# Altium schematic sheet CHRG 2xCell MCP73213-B6SIMF.SchDoc
size 224 x 90 mm
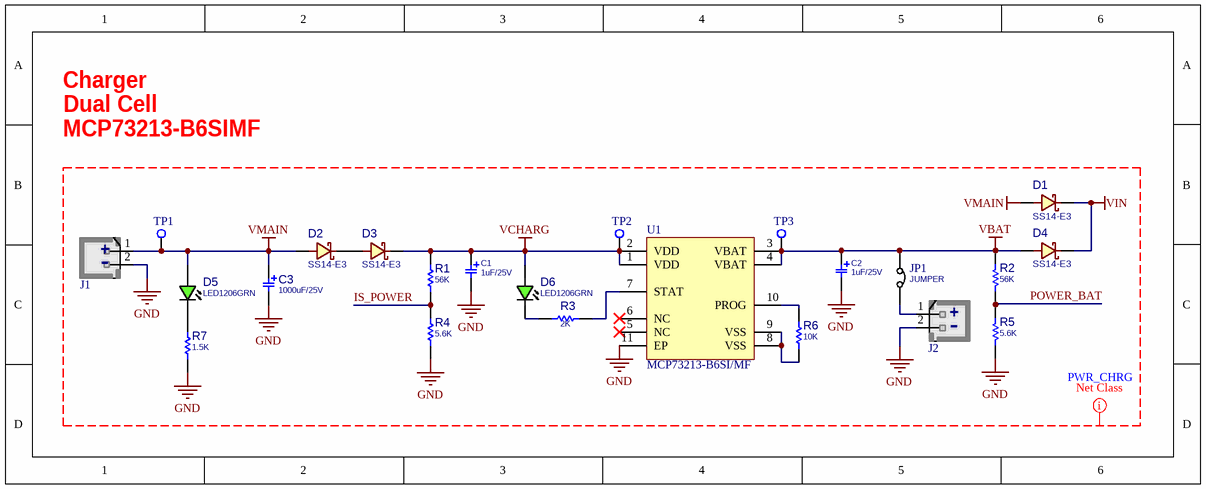
[diagram p0: CHRG 2xCell MCP73213-B6SIMF.SchDoc]

## Parts
C1  1uF/25V  [C_TN_A]
C2  1uF/25V  [C_TN_A]
C3  1000uF/25V  [C_EL_10X20]
D1  SS14-E3  [D_SMA]
D2  SS14-E3  [D_SMA]
D3  SS14-E3  [D_SMA]
D4  SS14-E3  [D_SMA]
D5  LED1206GRN  [LED1206GRN]
D6  LED1206GRN  [LED1206GRN]
J1  HHDR_2  [XH_2]  (value not drawn)
J2  HHDR_2  [XH_2]  (value not drawn)
JP1  JUMPER  [JP_2_BLK]
R1  56K  [R0603S]
R2  56K  [R0603S]
R3  2K  [R0603S]
R4  5.6K  [R0603S]
R5  5.6K  [R0603S]
R6  10K  [R0603S]
R7  1.5K  [R0603S]
TP1  Test Point  [TPSMD_C1]  (value not drawn)
TP2  Test Point  [TPSMD_C1]  (value not drawn)
TP3  Test Point  [TPSMD_C1]  (value not drawn)
U1  MCP73213-B6SI/MF  [SON50_10T_3X3]

## Nets
GND: C1.2 C2.2 C3.2 J1.2 J2.2 R4.1 R5.1 R7.1 U1.11(EP)
VBAT: C2.1 D4.1 JP1.1 R2.2 TP3.1(TP) U1.3(VBAT) U1.4(VBAT)
VCHARG: C1.1 D3.2 D6.1(ANODE) R1.2 TP2.1(TP) U1.1(VDD) U1.2(VDD)
VIN: D1.2 D4.2
VMAIN: C3.1 D1.1 D2.1 D5.1(ANODE) J1.1 TP1.1(TP)
IS_POWER: R1.1 R4.2
POWER_BAT: R2.1 R5.2
NetD2_2: D2.2 D3.1
NetD5_2: D5.2(CATHODE) R7.2
NetD6_2: D6.2(CATHODE) R3.2
NetJ2_1: J2.1 JP1.2
NetR3_1: R3.1 U1.7(STAT)
NetR6_1: R6.1 U1.10(PROG)
NetR6_2: R6.2 U1.8(VSS) U1.9(VSS)

Not connected (* = marked no-connect by the designer): U1 5(NC)* 6(NC)*

## Layout directives
net class PWR_CHRG: GND, IS_POWER, POWER_BAT, VBAT, VCHARG, VIN, VMAIN

## Notes on the sheet
- Charger
- MCP73213-B6SIMF
- Dual Cell
- PWR_CHRG
- (in symbol CONN_PW_POWER_CNT_254_1X2) +; -

## Library data of the parts
C1 C2 = CAP_SMD_TAN: CAP, SMD, TAN; PARAM: 25V; VALUE: 1uF/25V
C3 = CAP_THD_EL: CAP, THD, ELEC; MANF_P#: MANF_PART#; PARAM2: 20%; DESC: DESCRIPTION; DIST#: MOUSER; PARAM: 25V; PRICE: 10= 5$; MANF: MANF; ASSEMBLY: ASSEMBLY; VALUE: 1000uF/25V
D1-D4 = DIODE_SMD_SCHOTTKY_SS14-E3: DIODE, SCHOTTKY, 40V, 1A; MANF: Vishay; DESC: DESCRIPTION; ASSEMBLY: ASSEMBLY; PRICE: PRICE; PARAM2: 1A; PARAM: 40V; MANF_P#: SS14-E3; VALUE: SS14-E3
D5 D6 = LED_SMD_1206_GRN: LED, SMD, 1206, GREEN; PARAM: 20mA; DESC: DESCRIPTION; PARAM2: 2.2V; MANF: -; ASSEMBLY: ASSEMBLY; PRICE: 36t@Javan; MANF_P#: -; VALUE: LED1206GRN
J1 J2 = CONN_PW_POWER_CNT_254_1X2: CONN, CNT, pitch: 2.54mm, 2POS; VALUE: HHDR_2
JP1 = JUMPER_HDR_2P: JUMPER, HEADER 2PIN; MANF: MANF; MANF_P#: MANF_P#; VALUE: JUMPER
R1-R7 = RES_SMD: RES, SMD; MANF_P#: RK73H1ETTP4701F; MANF: KOA SPEER; PARAM: 0.063W; DESC: DESCRIPTION; DIST#: MOUSER; PARAM2: 1%; ASSEMBLY: ASSEMBLY; PRICE: 100= 0.5$
  R1 R2: VALUE: 56K
  R3: VALUE: 2K
  R4 R5: VALUE: 5.6K
  R6: VALUE: 10K
  R7: VALUE: 1.5K
U1 = MCP73213-B6SI/MF: Dual-Cell Li-Ion / Li-Polymer Battery Charge Management Controller with OVP, 13V, 10-Pin DFN, Industrial Temperature; Published: 2-Dec-2009; DatasheetVersion: revA, Jul-2009; PackageVersion: revBB, Aug-2009; PackageReference: DFN-MF10; Publisher: Altium Limited; PackageDescription: 10-Lead Plastic Dual Flat, No Lead Package (MF) - 3x3x0.9mm Body [DFN]; Supplier 1: Digi-Key; Supplier Part Number 1: MCP73213-B6SI/MF-ND; Supplier 2: Farnell; Supplier Part Number 2: 1800232; ComponentLink1Description: Datasheet; ComponentLink1URL: http://ww1.microchip.com/downloads/en/DeviceDoc/22190a.pdf; ComponentLink2Description: Packaging Specification; ComponentLink2URL: http://www.microchip.com/stellent/groups/techpub_sg/documents/packagingspec/en012702.pdf; ComponentLink3Description: Microchip.com Home; ComponentLink3URL: http://www.microchip.com/